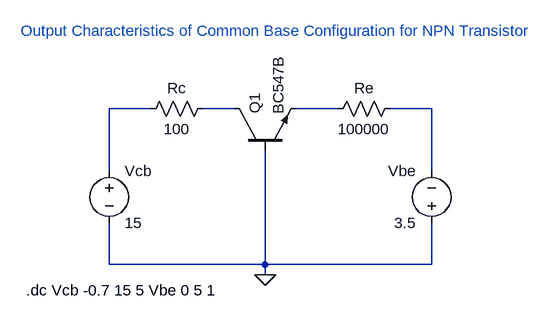
[diagram p0: schematic Assignment 5c (ii).asc]
Assignment 5c (ii).asc, the LTspice schematic file:
Version 4.1
SHEET 1 880 680
WIRE 48 96 -16 96
WIRE 176 96 128 96
WIRE 336 96 272 96
WIRE 480 96 416 96
WIRE -16 192 -16 96
WIRE 480 192 480 96
WIRE -16 336 -16 272
WIRE 224 336 224 160
WIRE 224 336 -16 336
WIRE 480 336 480 272
WIRE 480 336 224 336
WIRE 224 352 224 336
FLAG 224 352 0
SYMBOL npn 176 160 R270
SYMATTR InstName Q1
SYMATTR Value BC547B
SYMBOL voltage 480 288 R180
WINDOW 0 24 96 Left 2
WINDOW 3 24 16 Left 2
WINDOW 123 0 0 Left 0
WINDOW 39 0 0 Left 0
SYMATTR InstName Vbe
SYMATTR Value 3.5
SYMBOL voltage -16 176 R0
WINDOW 123 0 0 Left 0
WINDOW 39 0 0 Left 0
SYMATTR InstName Vcb
SYMATTR Value 15
SYMBOL res 144 80 R90
WINDOW 0 0 56 VBottom 2
WINDOW 3 32 56 VTop 2
SYMATTR InstName Rc
SYMATTR Value 100
SYMBOL res 432 80 R90
WINDOW 0 0 56 VBottom 2
WINDOW 3 32 56 VTop 2
SYMATTR InstName Re
SYMATTR Value 100000
TEXT -152 -24 Left 2 ;Output Characteristics of Common Base Configuration for NPN Transistor
TEXT -144 376 Left 2 !.dc Vcb -0.7 15 5 Vbe 0 5 1

The netlist it stands for:
* Assignment 5c (ii).asc
Q1 N002 0 N003 0 BC547B
Vbe 0 N004 3.5
Vcb N001 0 15
Rc N002 N001 100
Re N004 N003 100000
.model NPN NPN
.model PNP PNP
.lib standard.bjt
* Output Characteristics of Common Base Configuration for NPN Transistor
.dc Vcb -0.7 15 5 Vbe 0 5 1
.backanno
.end